# EAGLE design bms (EAGLE 9.6.2)
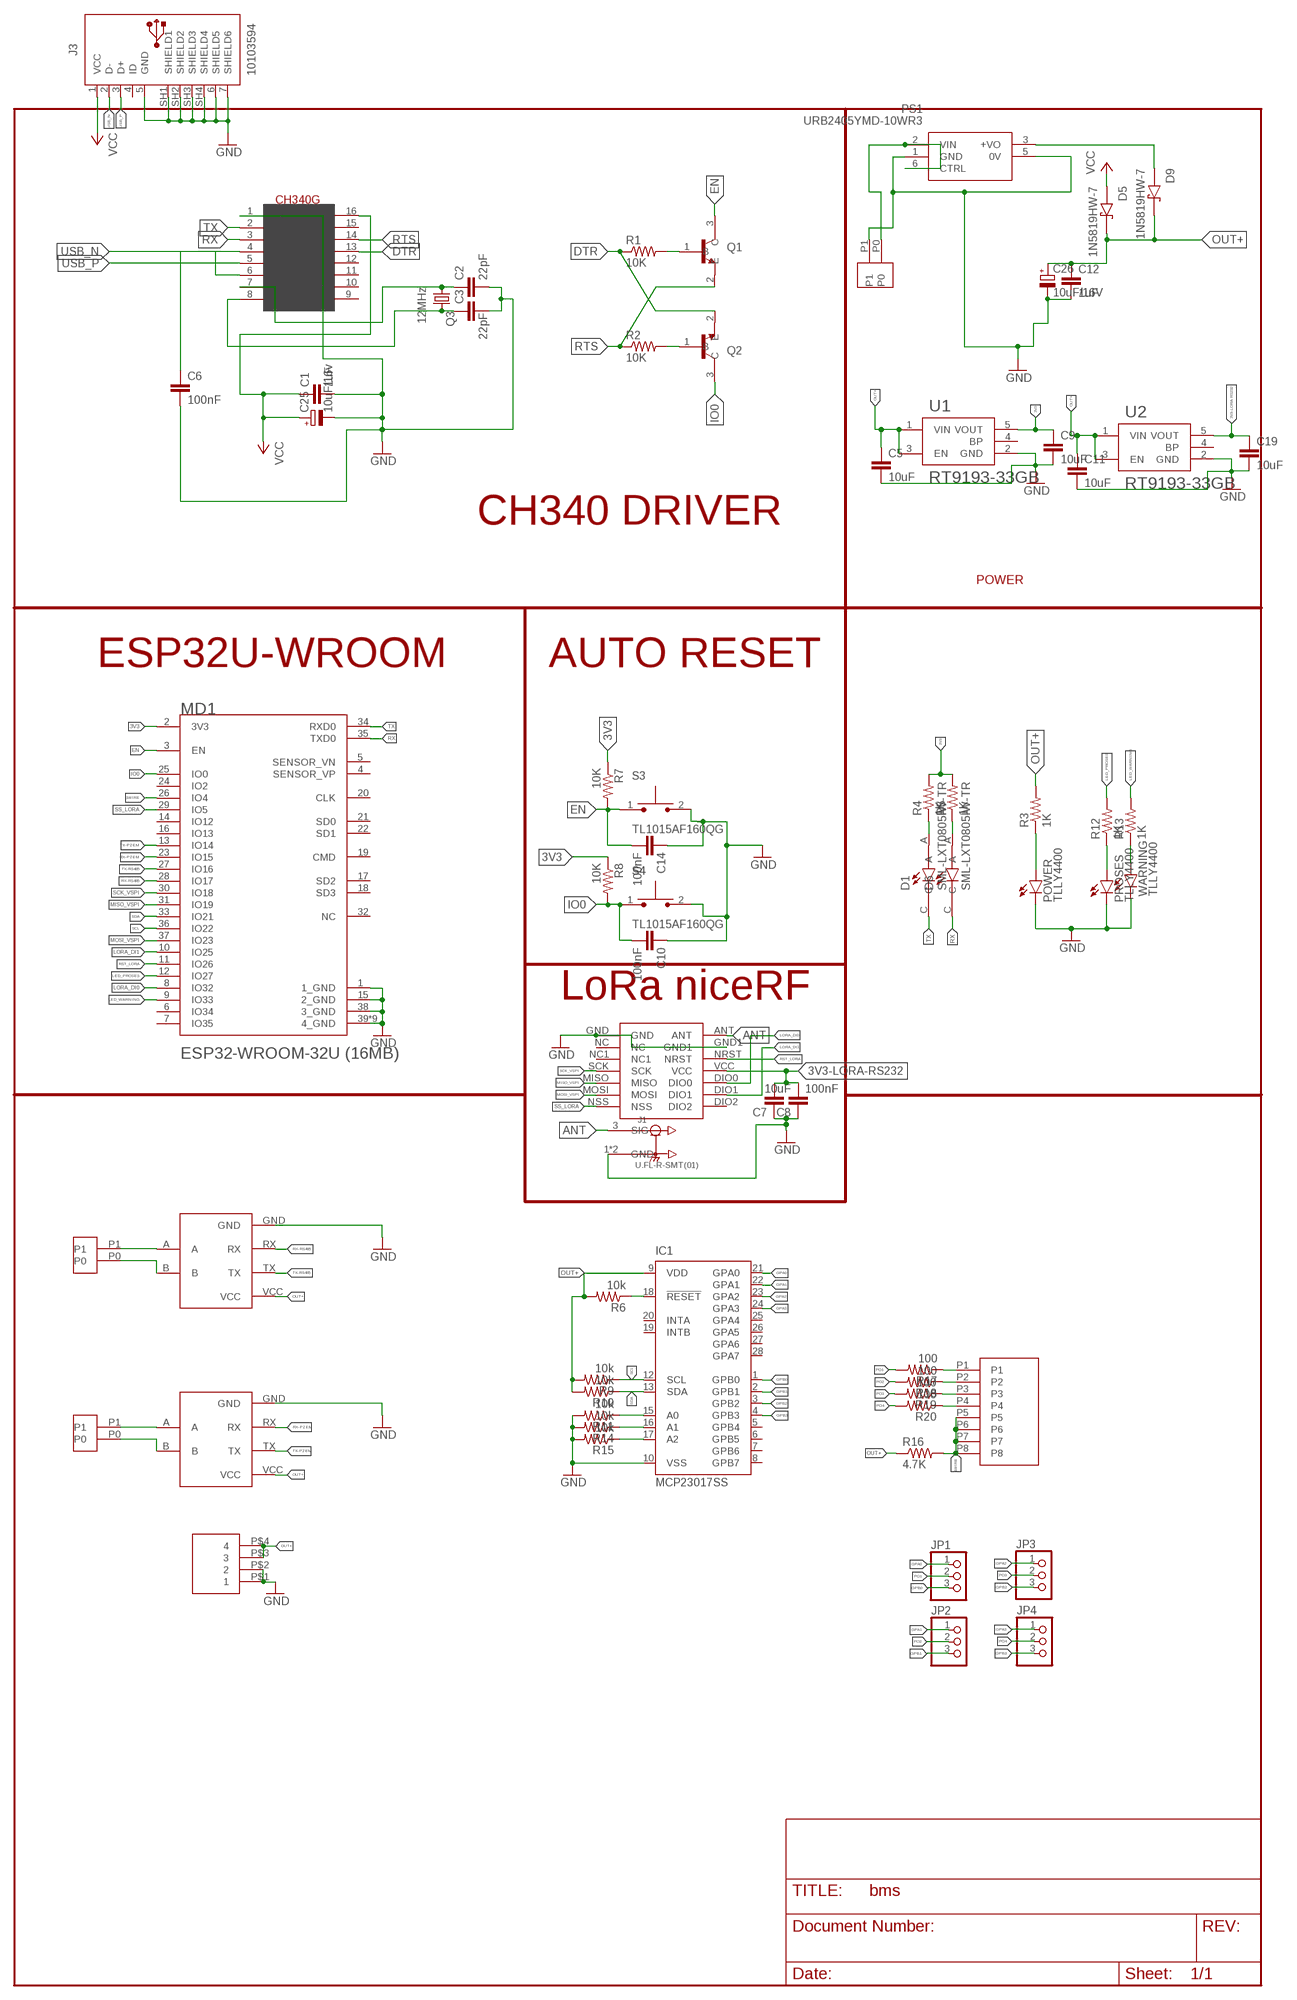
[diagram p0: schematic, sheet 1]

## Parts
C1  1uF  C-EUC0805K  [C0805K]
C2  22pF  C-EUC0805K  [C0805K]
C3  22pF  C-EUC0805K  [C0805K]
C5  10uF  C-EUC0805K  [C0805K]
C6  100nF  C-EUC0805K  [C0805K]
C7  10uF  C-EUC0805K  [C0805K]
C8  100nF  C-EUC0805K  [C0805K]
C9  10uF  C-EUC0805K  [C0805K]
C10  100nF  C-EUC0805K  [C0805K]
C11  10uF  C-EUC0805K  [C0805K]
C12  1uF  C-EUC0805K  [C0805K]
C14  100nF  C-EUC0805K  [C0805K]
C19  10uF  C-EUC0805K  [C0805K]
C25  10uF/16v  CPOL-EU153CLV-0505  [153CLV-0505]
C26  10uF/16V  CPOL-EU153CLV-0505  [153CLV-0505]
CONN2P-3.5PI1  CONN2P-3.5PI  [CONN2P-3.5PI]
CONN2P-3.5PI2  CONN2P-3.5PI  [CONN2P-3.5PI]
CONN2P-3.5PI3  CONN2P-3.5PI  [CONN2P-3.5PI]
CONN3.1  CONN3.5  [CONN3.5]
D1  SML-LXT0805IW-TR  [LEDC2012X120N]
D5  1N5819HW-7  [SOD3715X145N]
D6  SML-LXT0805IW-TR  [LEDC2012X120N]
D9  1N5819HW-7  [SOD3715X145N]
HEADER-3.81-1  HEADER-3.81-4  [HEADER-3.81-4]
IC1  MCP23017SS  [SSOP28]
J1  U.FL-R-SMT(01)  [HRS_U.FL-R-SMT(01)]
J3  10103594  [10103594]
JP1  PINHD-1X3  [1X03]
JP2  PINHD-1X3  [1X03]
JP3  PINHD-1X3  [1X03]
JP4  PINHD-1X3  [1X03]
LORA-NICERF-V1  LORA-NICERF-V2  [LORA-NICERF-V2]
MD1  ESPRESSIF_SYSTEMS_ESP32-WROOM-32U_16MBESPRESSIF_SYSTEMS_ESP32-WROOM-32U_16MB_0_0  [ESPRESSIF_SYSTEMS_ESP32-WROOM-32U_16MB_0]
POWER  TLLY4400  [LED3MM]
PROSES  TLLY4400  [LED3MM]
PS1  URB2405YMD-10WR3  [URB2405YMD10WR3]
Q1  MMBT3904  [SOT95P240X120-3N]
Q2  MMBT3904  [SOT95P240X120-3N]
Q3  12MHz  CRYSTALSM49  [SM49]
R1  10K  R-US_M0805  [M0805]
R2  10K  R-US_M0805  [M0805]
R3  1K  R-US_M0805  [M0805]
R4  1K  R-US_M0805  [M0805]
R5  1K  R-US_M0805  [M0805]
R6  10k  R-US_M0805  [M0805]
R7  10K  R-US_M0805  [M0805]
R8  10K  R-US_M0805  [M0805]
R9  10k  R-US_M0805  [M0805]
R10  10k  R-US_M0805  [M0805]
R11  10k  R-US_M0805  [M0805]
R12  1K  R-US_M0805  [M0805]
R13  1K  R-US_M0805  [M0805]
R14  10k  R-US_M0805  [M0805]
R15  10k  R-US_M0805  [M0805]
R16  4.7K  R-US_M0805  [M0805]
R17  100  R-US_M0805  [M0805]
R18  100  R-US_M0805  [M0805]
R19  100  R-US_M0805  [M0805]
R20  100  R-US_M0805  [M0805]
S3  TL1015AF160QG  [SW_TL1015AF160QG]
S4  TL1015AF160QG  [SW_TL1015AF160QG]
TTL-RS1  TTL-RS485  [TTL-RS485]
TTL-RS2  TTL-RS485  [TTL-RS485]
U1  RT9193-33GB  [SOT94P279X129-5N]
U2  RT9193-33GB  [SOT94P279X129-5N]
U$2  CH340G  [SOIC16]
WARNING  TLLY4400  [LED3MM]

## Nets
1WIRE: CONN3.1.P5 CONN3.1.P6 CONN3.1.P7 CONN3.1.P8 MD1.26(IO4) R16.2
3V3: C9.1 MD1.2(3V3) R4.2 R5.2 R7.1 R8.1 U1.5(VOUT)
3V3-LORA-RS232: C7.2 C8.2 C19.1 LORA-NICERF-V1.VCC U2.5(VOUT)
ANT: J1.3(SIG) LORA-NICERF-V1.ANT
DTR: Q2.2(E) R1.1 U$2.13(DTR)
EN: C14.2 MD1.3(EN) Q1.3(C) R7.2 S3.1
GND: C1.2 C2.2 C3.2 C5.2 C6.2 C7.1 C8.1 C9.2 C10.1 C11.2 C12.2 C14.1 C19.2 C25.- C26.- CONN2P-3.5PI1.P1 HEADER-3.81-1.P$1 HEADER-3.81-1.P$2 IC1.10(VSS) J1.1(GND) J1.2(GND) J3.5(GND) J3.6(SHIELD5) J3.7(SHIELD6) J3.SH1(SHIELD1) J3.SH2(SHIELD2) J3.SH3(SHIELD3) J3.SH4(SHIELD4) LORA-NICERF-V1.GND LORA-NICERF-V1.GND1 MD1.1(1_GND) MD1.15(2_GND) MD1.38(3_GND) MD1.39(4_GND) MD1.39-2(4_GND) MD1.39-3(4_GND) MD1.39-4(4_GND) MD1.39-5(4_GND) MD1.39-6(4_GND) MD1.39-7(4_GND) MD1.39-8(4_GND) MD1.39-9(4_GND) POWER.K(C) PROSES.K(C) PS1.1(GND) PS1.5(0V) R11.2 R14.2 R15.2 S3.2 S4.2 TTL-RS1.GND TTL-RS2.GND U1.2(GND) U2.2(GND) U$2.1(GND) WARNING.K(C)
GPA0: IC1.21(GPA0) JP1.1
GPA1: IC1.22(GPA1) JP2.1
GPA2: IC1.23(GPA2) JP3.1
GPA3: IC1.24(GPA3) JP4.1
GPB0: IC1.1(GPB0) JP1.3
GPB1: IC1.2(GPB1) JP2.3
GPB2: IC1.3(GPB2) JP3.3
GPB3: IC1.4(GPB3) JP4.3
IO0: C10.2 MD1.25(IO0) Q2.3(C) R8.2 S4.1
LED_PROSES: MD1.12(IO27) R12.2
LED_WARNING: MD1.9(IO33) R13.2
LORA_DI0: LORA-NICERF-V1.DIO0 MD1.8(IO32)
LORA_DI1: LORA-NICERF-V1.DIO1 MD1.10(IO25)
MISO_VSPI: LORA-NICERF-V1.MISO MD1.31(IO19)
MOSI_VSPI: LORA-NICERF-V1.MOSI MD1.37(IO23)
N$1: C2.1 Q3.1 U$2.7(XI)
N$2: C3.1 Q3.2 U$2.8(XO)
N$3: POWER.A R3.1
N$4: Q1.1(B) R1.2
N$5: Q2.1(B) R2.2
N$6: CONN2P-3.5PI3.P1 TTL-RS2.A
N$7: CONN2P-3.5PI2.P1 TTL-RS1.A
N$8: D1.A R4.1
N$9: D6.A R5.1
N$10: CONN2P-3.5PI2.P0 TTL-RS1.B
N$11: CONN2P-3.5PI1.P0 PS1.2(VIN) PS1.6(CTRL)
N$12: C6.1 U$2.4(V3)
N$13: CONN2P-3.5PI3.P0 TTL-RS2.B
N$14: IC1.18(!RESET) R6.1
N$15: CONN3.1.P4 R20.1
N$16: D9.A PS1.3(+VO)
N$17: CONN3.1.P3 R19.1
N$18: IC1.15(A0) R11.1
N$19: IC1.16(A1) R14.1
N$20: IC1.17(A2) R15.1
N$21: CONN3.1.P2 R18.1
N$22: CONN3.1.P1 R17.1
N$25: PROSES.A R12.1
N$28: R13.1 WARNING.A
OUT+: C5.1 C11.1 C12.1 C26.+ D5.C(K) D9.C(K) HEADER-3.81-1.P$3 HEADER-3.81-1.P$4 IC1.9(VDD) R3.2 R6.2 R9.2 R10.2 R16.1 TTL-RS1.VCC TTL-RS2.VCC U1.1(VIN) U1.3(EN) U2.1(VIN) U2.3(EN)
PO1: JP1.2 R17.2
PO2: JP2.2 R18.2
PO3: JP3.2 R19.2
PO4: JP4.2 R20.2
RST_LORA: LORA-NICERF-V1.NRST MD1.11(IO26)
RTS: Q1.2(E) R2.1 U$2.14(RTS)
RX: D6.C MD1.35(TXD0) U$2.3(RX)
RX-PZEM: MD1.23(IO15) TTL-RS2.RX
RX-RS485: MD1.28(IO17) TTL-RS1.RX
SCK_VSPI: LORA-NICERF-V1.SCK MD1.30(IO18)
SCL: IC1.12(SCL) MD1.36(IO22) R9.1
SDA: IC1.13(SDA) MD1.33(IO21) R10.1
SS_LORA: LORA-NICERF-V1.NSS MD1.29(IO5)
TX: D1.C MD1.34(RXD0) U$2.2(TX)
TX-PZEM: MD1.13(IO14) TTL-RS2.TX
TX-RS485: MD1.27(IO16) TTL-RS1.TX
USB_N: J3.2(D-) U$2.6(D-)
USB_P: J3.3(D+) U$2.5(D+)
VCC: C1.1 C25.+ D5.A J3.1(VCC) U$2.16(VCC)
Unconnected: IC1.5(GPB4) IC1.6(GPB5) IC1.7(GPB6) IC1.8(GPB7) IC1.19(INTB) IC1.20(INTA) IC1.25(GPA4) IC1.26(GPA5) IC1.27(GPA6) IC1.28(GPA7) J3.4(ID) LORA-NICERF-V1.DIO2 LORA-NICERF-V1.NC LORA-NICERF-V1.NC1 MD1.4(SENSOR_VP) MD1.5(SENSOR_VN) MD1.6(IO34) MD1.7(IO35) MD1.14(IO12) MD1.16(IO13) MD1.17(SD2) MD1.18(SD3) MD1.19(CMD) MD1.20(CLK) MD1.21(SD0) MD1.22(SD1) MD1.24(IO2) MD1.32(NC) U1.4(BP) U2.4(BP) U$2.9(CTS) U$2.10(DSR) U$2.11(RI) U$2.12(DCD) U$2.15(RS232)

## Notes on the sheet
- CH340 DRIVER
- POWER
- ESP32U-WROOM | AUTO RESET
- LoRa niceRF

## Library data of the parts
C1-C3 C5-C12 C14 C19 = rcl:C-EU: CAPACITOR, European symbol; SPICEPREFIX: C
C25 C26 = rcl:CPOL-EU: POLARIZED CAPACITOR, European symbol; SPICEPREFIX: C
CONN2P-3.5PI1-CONN2P-3.5PI3 = CONN2P-3.5PI:CONN2P-3.5PI
CONN3.1 = CONN3.5:CONN3.5
D1 D6 = SML-LXT0805IW-TR:SML-LXT0805IW-TR: LED; Luminous Intensity:11µcd; Viewing Angle:140°; Forward Current:30mA; Forward Voltage:2V; Color:Red; LED Color:Red; Leaded Process Compatible:Yes; Lens Color:White; Mounting Type:Surface Mount ;RoHS Compliant: Yes Check availability <https://pricing.snapeda.com/parts/SML-LXT0805IW-TR/Lumex%20Opto/Components/view-part?ref=eda>; AVAILABILITY: In Stock; DESCRIPTION: Red - LED Indication - Discrete 2V 0805 (2012 Metric); MF: Lumex Opto/Components; MP: SML-LXT0805IW-TR; PACKAGE: 0805 Lumex; PRICE: None; PURCHASE-URL: https://pricing.snapeda.com/search/part/SML-LXT0805IW-TR/?ref=eda
D5 D9 = 1N5819HW-7:1N5819HW-7: 1N5819HW Series 40 V 1 A Surface Mount Schottky Barrier Rectifier - SOD-123 Check availability <https://pricing.snapeda.com/parts/1N5819HW-7/Diodes%20Inc./view-part?ref=eda>; AVAILABILITY: In Stock; DESCRIPTION: Diode Schottky 40 V 1A Surface Mount SOD-123; MF: Diodes Inc.; MP: 1N5819HW-7; PACKAGE: SOD-123 Fairchild Semiconductor; PRICE: None; PURCHASE-URL: https://pricing.snapeda.com/search/part/1N5819HW-7/?ref=eda
HEADER-3.81-1 = HEADER-3.81-4:HEADER-3.81-4
IC1 = microchip:MCP23017: http://ww1.microchip.com/downloads/en/DeviceDoc/21952a.pdf Source: http://ww1.microchip.com/downloads/en/DeviceDoc/21952a.pdf; MF: MICROCHIP; MPN: MCP23017-E/SS; OC_FARNELL: 1467674; OC_NEWARK: 31K2960
J1 = U.FL-R-SMT_01_:U.FL-R-SMT(01): U.FL Series 6 Ghz 50 Ohm Ultra-small SMT Coaxial Cable Receptacle Check availability <https://pricing.snapeda.com/parts/U.FL-R-SMT%2801%29/Hirose/view-part?ref=eda>; AVAILABILITY: In Stock; DESCRIPTION: U.FL (UMCC) Connector Receptacle, Male Pin 50Ohm Surface Mount Solder. RF Connectors / Coaxial Connectors; MF: Hirose; MP: U.FL-R-SMT(01); PACKAGE: None; PRICE: None; PURCHASE-URL: https://pricing.snapeda.com/search/part/U.FL-R-SMT(01)/?ref=eda
J3 = Connector_USB:10103594: USB(2.0) Micro-B, RCPT, 5POS, SMD-THT-R/A Datasheet <https://cdn.amphenol-icc.com/media/wysiwyg/files/documentation/datasheet/inputoutput/io_usb_micro.pdf> Drawing <https://cdn.amphenol-icc.com/media/wysiwyg/files/drawing/10103594.pdf>; CATEGORY: Connectors; CONTACTS: 5; CURRENT-RATING: 1.8A; DESCRIPTION: CONN RCPT USB2.0 MICRO B SMD R/A; GENDER: Receptacle; MANUFACTURER: Amphenol ICC (FCI); MOUNT_TYPE: R/A; MPN: 10103594-0001LF; OPERATING_TEMPERATURE: -30°C ~ 80°C; PART_STATUS: ACTIVE; ROHS_COMPLIANT: COMPLIANT; SUB_CATEGORY: USB; TYPE: USB-micro B; VOLTAGE-RATING: 100VAC
JP1-JP4 = pinhead:PINHD-1X3: PIN HEADER
LORA-NICERF-V1 = LORA-NICERF-V2:LORA-NICERF-V2
MD1 = Espressif Systems - ESP32-WROOM-32U (16MB):ESPRESSIF_SYSTEMS_ESP32-WROOM-32U_16MB: Bluetooth, WiFi 802.11b/g/n, Bluetooth v4.2 +EDR, Class 1, 2 and 3 Transceiver Module 2.4GHz ~ 2.5GHz Antenna Not Included, U.FL Surface Mount; AUTOMOTIVE: No; BANDWIDTH: 72MHz; CENTROID_NOT_SPECIFIED: No; DATASHEET: https://www.espressif.com/sites/default/files/documentation/esp32-wroom-32d_esp32-wroom-32u_datasheet_en.pdf; DATA_RATE: 150Mbits/s; DEVICE_CLASS_L1: Integrated Circuits (ICs); DEVICE_CLASS_L2: RF Semiconductors and Devices; DEVICE_CLASS_L3: Transceivers; DIGIKEY_DESCRIPTION: RX TXRX MODULE WIFI U.FL SMD; DIGIKEY_PART_NUMBER: 1904-1028-1-ND; FOOTPRINT_VARIANT_NAME_0: Recommended_Land_Pattern; HEIGHT: 3.35mm; INTERFACE: I2C,SPI,UART,Ethernet,I2S,Other; LEAD_FREE: Yes; MAX_FREQUENCY: 2484MHz; MAX_SUPPLY_VOLTAGE: 3.6V; MF: Espressif Systems; MFG_PACKAGE_IDENT: 0; MFG_PACKAGE_IDENT_DATE: 0; MFG_PACKAGE_IDENT_REV: 0; MIN_SUPPLY_VOLTAGE: 3V; MOUSER_PART_NUMBER: 356-ES32WROOM32U16MB; MPN: ESP32-WROOM-32U (16MB); NOMINAL_SUPPLY_CURRENT: 0.5A; NUMBER_OF_ADC_CHANNELS: 16; NUMBER_OF_GPIO: 26; PACKAGE: BT_MODULE; PREFIX: MD; ROHS: Yes; SENSITIVITY: -98dBm; TEMPERATURE_RANGE_HIGH: +85°C; TEMPERATURE_RANGE_LOW: -40°C; VERIFICATION_VERSION: 0.0.0.3
POWER PROSES WARNING = led:TLLY4400: Low Current (2mA) LED 3 mm Tinted Diffused Package color YELLOW Source: Data sheet <http://www.farnell.com/datasheets/391098.pdf>; MF: VISHAY SEMICONDUCTOR; OC_FARNELL: 1612439
PS1 = URB2405YMD-10WR3:URB2405YMD-10WR3: Isolated Module DC DC Converter 1 Output 5V 2A 9V - 36V Input Source: Datasheet <https://www.mornsun-power.com/html/pdf/URB2405YMD-10WR3.html>; DESCRIPTION: Isolated Module DC DC Converter 1 Output 5V 2A 9V - 36V Input; HEIGHT: 12.2mm; MANUFACTURER_NAME: Mornsun Power; MANUFACTURER_PART_NUMBER: URB2405YMD-10WR3
Q1 Q2 = MMBT3904:MMBT3904: MMBT3904 Series 40 V CE Breakdown 0.2 A NPN General Purpose Amplifier - SOT-23 Check availability <https://pricing.snapeda.com/parts/MMBT3904/STMicroelectronics/view-part?ref=eda>; AVAILABILITY: Not in stock; DESCRIPTION: SMD Transistor MMBT3904 SOT-23 SMD DIOTEC; MF: STMicroelectronics; MP: MMBT3904; PACKAGE: SOT-23 ON; PRICE: None
Q3 = adafruit:CRYSTAL: CRYSTAL; OC_FARNELL: unknown; OC_NEWARK: unknown
R1-R20 = adafruit:R-US_: RESISTOR, American symbol
S3 S4 = TL1015AF160QG:TL1015AF160QG: Tactile Switch SPST-NO Top Actuated Surface Mount Check availability <https://pricing.snapeda.com/parts/TL1015AF160QG/E-Switch/view-part?ref=eda>; AVAILABILITY: In Stock; DESCRIPTION: Tactile Switch SPST-NO Top Actuated Surface Mount; MF: E-Switch; MP: TL1015AF160QG; PACKAGE: None; PRICE: None; PURCHASE-URL: https://pricing.snapeda.com/search/part/TL1015AF160QG/?ref=eda
TTL-RS1 TTL-RS2 = TTL-RS485:TTL-RS485
U1 U2 = RT9193-33GB:RT9193-33GB: RT9193 Series 300 mA 3.3 V Ultra-Low Noise Ultra-Fast CMOS LDO Regulator-SC-70-5 Check availability <https://pricing.snapeda.com/parts/RT9193-33GB/Richtek%20USA%20Inc./view-part?ref=eda>; AVAILABILITY: In Stock; DESCRIPTION: Linear Voltage Regulator IC Positive Fixed 1 Output 300mA SOT-23-5; MF: Richtek USA Inc.; MP: RT9193-33GB; PACKAGE: SOT-23-5 Richtek; PRICE: None; PURCHASE-URL: https://pricing.snapeda.com/search/part/RT9193-33GB/?ref=eda
U$2 = usb-serial:CH340G

## Net classes
0 default: width 0.2 mm, clearance 0.15 mm

## Board
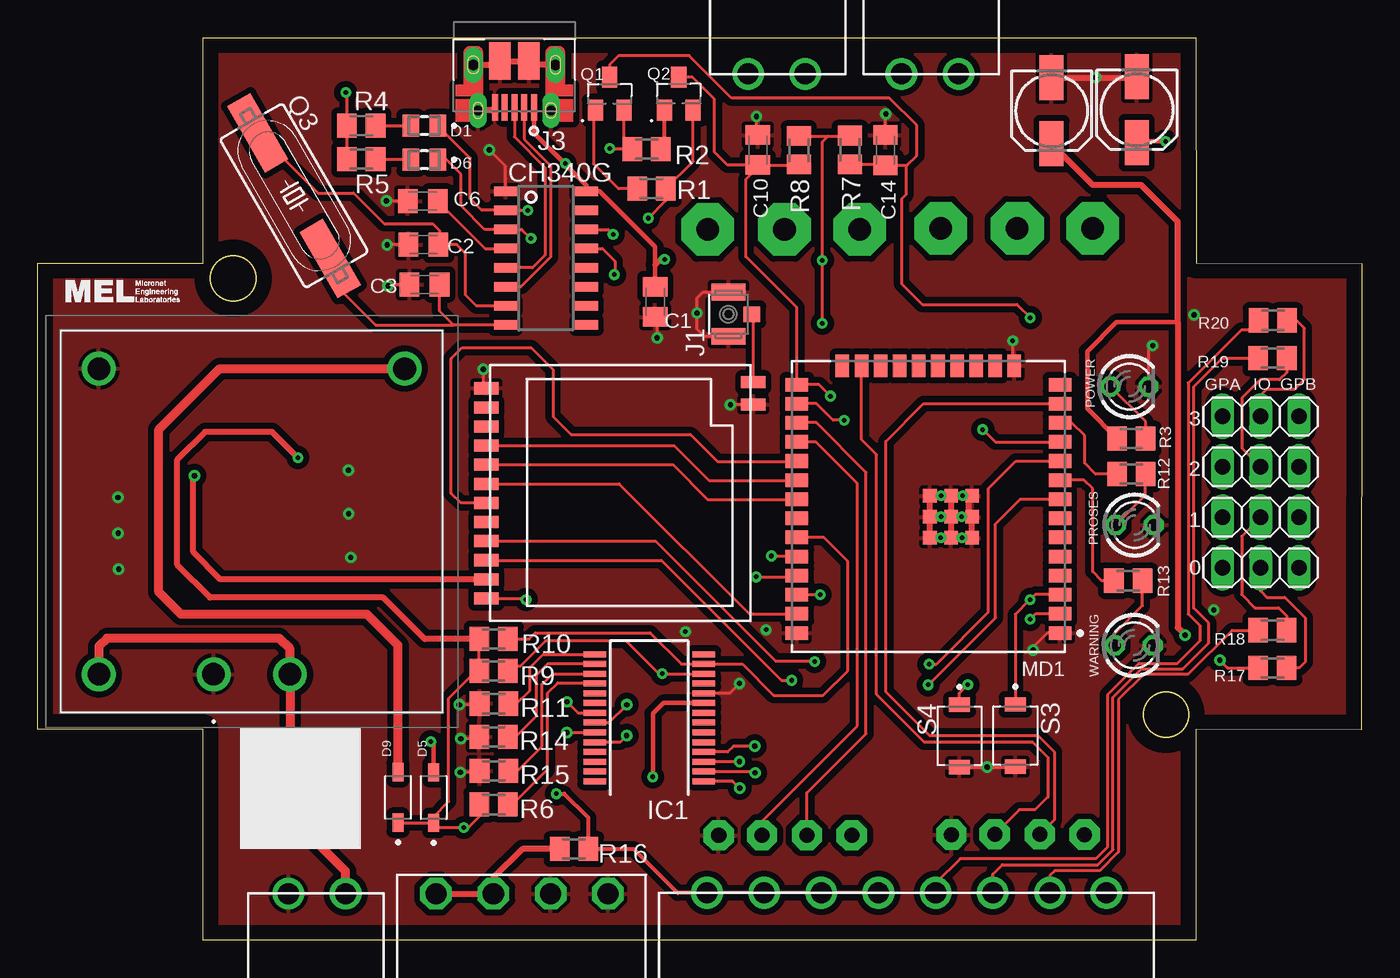
[diagram p1: board, top side]
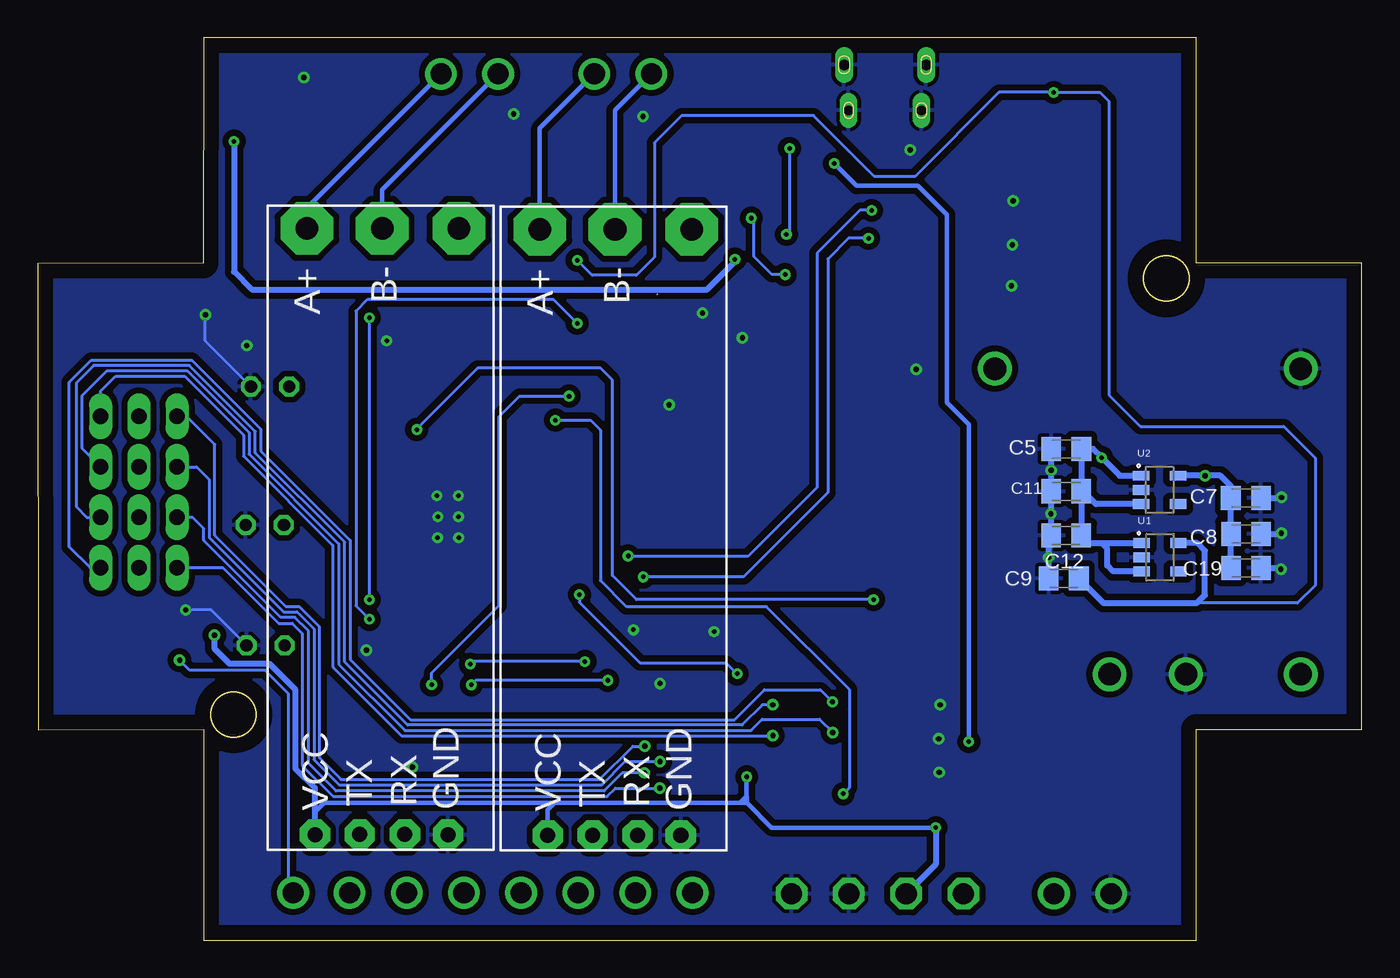
[diagram p2: board, bottom side, seen from below]

Size 88.02 x 60 mm. Coordinates in mm from the lower left corner, seen from the top.
Outline: 11,60 77,60 77.03,44.99 88.03,44.98 87.99,13.99 76.99,14.01 77,0 11,0 11,14 0,14 0,45 11,45 11,60
Outline: circle at 13,44 radius 1.5
Outline: circle at 75,15 radius 1.5
Copper layers (1*16): Top 0.035mm / dielectric 1.5mm / Bottom 0.035mm
Design rules "default *": minimum track width 6mil, minimum drill 0.3mm, track to track 6mil, track to pad 6mil, pad to pad 6mil, via to via 6mil, smd to smd 6mil, copper to edge 40mil, drill to drill 6mil, minimum pad ring 10mil, minimum via ring 8mil, stop-mask expansion 4mil, vias tented up to drill 0mil, thermal gap 10mil

### Footprints (pad centres in the part's own frame; a part is rotated, then mirrored left to right if it is on the bottom)
C0805K = smd 1.3 x 1.6: 1 -1,0; 2 1,0
153CLV-0505 = smd 3 x 1.6: + 2.2,0; - -2.2,0
CONN2P-3.5PI = drill 1.4: P0 2.521,0.016; P1 6.321,0.016
CONN3.5 = drill 1.4: P1 -26.75,0; P2 -23,0; P3 -19.2,0; P4 -15.4,0; P5 -11.6,0; P6 -7.8,0; P7 -4,0; P8 -0.2,0
LEDC2012X120N = smd 1.1 x 1.45: A 0.9,0; C -0.9,0
SOD3715X145N = smd 1.21 x 0.73: A 1.68,0; C -1.68,0
HEADER-3.81-4 = drill 1.4 octagon: P$1 0,0; P$2 3.81,0; P$3 7.62,0; P$4 11.43,0
SSOP28 = smd 0.4 x 1.5: 1 -4.225,-3.625; 2 -3.575,-3.625; 3 -2.925,-3.625; 4 -2.275,-3.625; 5 -1.625,-3.625; 6 -0.975,-3.625; 7 -0.325,-3.625; 8 0.325,-3.625; 9 0.975,-3.625; 10 1.625,-3.625; 11 2.275,-3.625; 12 2.925,-3.625; 13 3.575,-3.625; 14 4.225,-3.625; 15 4.225,3.625; 16 3.575,3.625; 17 2.925,3.625; 18 2.275,3.625; 19 1.625,3.625; 20 0.975,3.625; 21 0.325,3.625; 22 -0.325,3.625; 23 -0.975,3.625; 24 -1.625,3.625; 25 -2.275,3.625; 26 -2.925,3.625; 27 -3.575,3.625; 28 -4.225,3.625
HRS_U.FL-R-SMT(01) = smd 1.1 x 2.25: 1 -1.475,0; 2 1.475,0 | smd 1.05 x 1.1: 3 0,-1.55
10103594 = smd 0.4 x 1.75: 1 -1.3,2.825; 2 -0.65,2.825; 3 0,2.825; 4 0.65,2.825; 5 1.3,2.825 | smd 1.425 x 2.5: 6 -0.963,-0.25; 7 0.963,-0.25 | drill 0.65 pad 0.73 long: SH1 -2.425,3.03; SH2 2.425,3.03 | drill 0.7 long: SH3 -2.725,0; SH4 2.725,0
1X03 = drill 1.016 long: 1 -2.54,0; 2 0,0; 3 2.54,0
LORA-NICERF-V2 = smd 1.6 x 0.8: ANT 9.17,6.81; DIO0 -8.57,-5.03; DIO1 -8.57,-3.76; DIO2 -8.57,-2.49; GND -8.57,6.4; GND1 9.17,5.31; MISO -8.57,1.32; MOSI -8.57,0.05; NC -8.57,5.13; NC1 -8.57,3.86; NRST -8.57,-7.57; NSS -8.57,-1.22; SCK -8.57,2.59; VCC -8.57,-6.3
ESPRESSIF_SYSTEMS_ESP32-WROOM-32U_16MB_0 = smd 1.5 x 0.9: 1 -8.75,8.41; 2 -8.75,7.14; 3 -8.75,5.87; 4 -8.75,4.6; 5 -8.75,3.33; 6 -8.75,2.06; 7 -8.75,0.79; 8 -8.75,-0.48; 9 -8.75,-1.75; 10 -8.75,-3.02; 11 -8.75,-4.29; 12 -8.75,-5.56; 13 -8.75,-6.83; 14 -8.75,-8.1; 25 8.75,-8.1; 26 8.75,-6.83; 27 8.75,-5.56; 28 8.75,-4.29; 29 8.75,-3.02; 30 8.75,-1.75; 31 8.75,-0.48; 32 8.75,0.79; 33 8.75,2.06; 34 8.75,3.33; 35 8.75,4.6; 36 8.75,5.87; 37 8.75,7.14; 38 8.75,8.41 | smd 0.9 x 1.5: 15 -5.71,-9.35; 16 -4.44,-9.35; 17 -3.17,-9.35; 18 -1.9,-9.35; 19 -0.63,-9.35; 20 0.64,-9.35; 21 1.91,-9.35; 22 3.18,-9.35; 23 4.45,-9.35; 24 5.72,-9.35 | smd 0.9 x 0.9: 39 -2.9,2.09; 39-2 -1.5,0.69; 39-3 -1.5,2.09; 39-4 -0.1,2.09; 39-5 -0.1,-0.71; 39-6 -1.5,-0.71; 39-7 -2.9,-0.71; 39-8 -0.1,0.69; 39-9 -2.9,0.69
LED3MM = drill 0.813 octagon: A -1.27,0; K 1.27,0
URB2405YMD10WR3 = drill 1.5 pad 2.25: 1 0,0; 2 -5.08,0; 3 -12.7,-20.32; 5 7.62,-20.32; 6 7.62,0
SOT95P240X120-3N = smd 1 x 1.4: 1 -0.95,-1.1; 2 0.95,-1.1; 3 0,1.1
SM49 = smd 5.08 x 1.778: 1 -4.826,0; 2 4.826,0
M0805 = smd 1.3 x 1.6: 1 -0.95,0; 2 0.95,0
SW_TL1015AF160QG = smd 0.95 x 1.4: 1 -2.075,0; 2 2.075,0
TTL-RS485 = drill 1.5 pad 3.5 octagon: A -19.7,-6; B -19.7,-1; P$7 -19.7,4.1 | drill 1 pad 2 octagon: GND 20.6,3.37; RX 20.581,0.505; TX 20.583,-2.493; VCC 20.6,-5.47
SOT94P279X129-5N = smd 1.17 x 0.67: 1 -1.22,0.94; 2 -1.22,0; 3 -1.22,-0.94; 4 1.22,-0.94; 5 1.22,0.94
SOIC16 = smd 0.635 x 1.524: 1 -4.445,-2.695; 2 -3.175,-2.695; 3 -1.905,-2.695; 4 -0.635,-2.695; 5 0.635,-2.695; 6 1.905,-2.695; 7 3.175,-2.695; 8 4.445,-2.695; 9 4.445,2.695; 10 3.175,2.695; 11 1.905,2.695; 12 0.635,2.695; 13 -0.635,2.695; 14 -1.905,2.695; 15 -3.175,2.695; 16 -4.445,2.695

### Placement (x,y rotation side)
C1  41.05,42.44 270 top
C2  25.65,46.24 180 top
C3  25.72,43.59 180 top
C5  19.65,32.65 180 bottom
C6  25.6,49.12 180 top
C7  7.71,29.39 180 bottom
C8  7.7,27.01 180 bottom
C9  19.81,24.04 180 bottom
C10  47.87,52.52 270 top
C11  19.65,29.84 180 bottom
C12  19.65,26.89 180 bottom
C14  56.36,52.52 270 top
C19  7.7,24.74 0 bottom
C25  73.06,55.21 270 top
C26  67.4,55.14 270 top
CONN2P-3.5PI1  22.99,3.1 180 top
CONN2P-3.5PI2  44.7,57.57 0 top
CONN2P-3.5PI3  54.9,57.58 0 top
CONN3.1  44.29,3.15 180 top
D1  25.7,54.15 180 top
D5  26.33,9.48 90 top
D6  25.7,51.88 180 top
D9  23.96,9.49 90 top
HEADER-3.81-1  37.91,3.09 180 top
IC1  40.66,14.79 90 top
J1  45.92,41.61 90 top
J3  31.69,58.19 180 top
JP1  81.3,24.76 180 top
JP2  81.3,28.11 180 top
JP3  81.3,31.46 180 top
JP4  81.3,34.82 180 top
LORA-NICERF-V1  38.4,30.29 0 top
MD1  59.21,28.83 180 top
POWER  72.58,36.81 0 top
PROSES  72.93,27.6 0 top
PS1  11.69,17.67 180 top
Q1  38.02,56.27 0 top
Q2  42.62,56.28 0 top
Q3  17.04,49.49 300 top
R1  40.8,49.95 180 top
R2  40.48,52.59 0 top
R3  72.7,33.34 180 top
R4  21.52,54.15 180 top
R5  21.52,51.91 180 top
R6  30.31,9.01 180 top
R7  53.99,52.53 270 top
R8  50.6,52.51 270 top
R9  30.31,17.89 180 top
R10  30.32,20.02 180 top
R11  30.33,15.72 180 top
R12  72.69,30.98 180 top
R13  72.49,23.89 180 top
R14  30.31,13.51 180 top
R15  30.33,11.26 180 top
R16  35.65,6.07 0 top
R17  82.08,18.1 0 top
R18  82.08,20.61 0 top
R19  82.08,38.7 0 top
R20  82.11,41.21 0 top
S3  64.99,13.6 270 top
S4  61.28,13.58 270 top
TTL-RS1  48.64,27.55 270 bottom
TTL-RS2  64.12,27.61 270 bottom
U1  13.42,25.45 0 bottom
U2  13.45,29.93 0 bottom
U$2  33.79,45.34 270 top
WARNING  72.87,19.6 0 top

### Tracks (layer width: path | path; a pad name or v marks a point on that pad's centre or on a via)
1WIRE  (via drill 0.3)
  Top 0.203: CONN3.1.P5 CONN3.1.P6 CONN3.1.P7 CONN3.1.P8 | v53.61,34.57 52.87,34.57 51.78,35.66 MD1.26
  Top 0.254: v34.48,9.73 35,9.73 36.6,8.16 R16.2 39.62,6.07 42.54,3.15 CONN3.1.P8
  Bottom 0.203: v34.48,9.73 34.07,10.14 34.07,16.66 39.57,22.16 48.87,22.16 50.62,23.91 50.62,33.91 51.27,34.57 v53.61,34.57
3V3  (via drill 0.3)
  Top 0.203: R5.2 R4.2 | R4.2 | R8.1 52.54,53.46 | 52.54,53.46 53.97,53.46 R7.1 | MD1.2 66.33,21.69 v65.97,21.33 | v52.16,41.02 v52.16,45.2 52.16,53.08 52.54,53.46 | R4.2 20.57,56.31 20.5,56.38 | 20.5,56.38 | 20.5,56.38 v20.48,56.36
  Bottom 0.203: v65.97,21.33 66.86,22.22 66.86,41.83 66.09,42.6 53.75,42.6 v52.16,41.02 | 11.38,22.4 4.28,22.4 3.11,23.57 3.11,32.06 5.2,34.16 14.72,34.16 16.81,36.25 16.81,55.77 17.4,56.36 v20.48,56.36 24.11,56.36 29.7,50.77 32.41,50.77 36.45,54.81 45.22,54.81 47.02,53.01 47.02,45.41 48.23,44.21 51.17,44.21 v52.16,45.2
  Bottom 0.305: 18.7,23.93 C9.1
  Bottom 0.406: C9.1 17.17,22.4 11.38,22.4 10.98,22.4 10.43,22.95 10.43,25.88 10.94,26.39 U1.5
3V3-LORA-RS232  (via drill 0.35)
  Top 0.406: LORA-NICERF-V1.VCC 12.15,23.99 10.34,25.79 10.34,30.86 10.42,30.93 v10.42,30.87
  Bottom 0.406: U2.5 v10.42,30.87 9.4,30.87 8.71,30.19 C7.2 C8.2 | C19.1 C8.2 | C8.2
ANT
  Top 0.203: LORA-NICERF-V1.ANT 47.57,41.51 J1.3
DTR  (via drill 0.3)
  Top 0.203: Q2.2 43.57,51.77 R1.1 41.75,49.16 v40.59,48 | U$2.13 37.53,45.98 38.38,45.14 38.38,44.29 v38.34,44.25
  Bottom 0.203: v38.34,44.25 39.2,44.25 40.43,45.48 40.43,47.84 v40.59,48
EN  (via drill 0.3)
  Top 0.203: R7.2 56.29,51.58 C14.2 57.71,51.52 | 57.71,51.52 57.79,51.52 58.43,52.16 58.43,54.17 56.62,55.98 46.13,55.98 43.3,58.81 38.63,58.81 38.02,58.2 Q1.3 | S3.1 64.99,21.66 v65.97,22.64 66.34,23.01 67.91,23.01 MD1.3 | 57.71,51.52 57.71,49.56 57.43,49.28 57.43,43.63 58.8,42.26 65.1,42.26 v65.98,41.38
  Bottom 0.203: v65.98,41.38 65.98,22.73 65.92,22.67 65.95,22.64 v65.97,22.64
GND  (via drill 0.3, 0.35)
  Top 0.203: R15.2 29.26,11.15 v28.1,11.15 | R14.2 29.24,13.39 v28.14,13.39 | R11.2 29.3,15.64 v28.03,15.64 | v46.65,17.06 46,16.41 IC1.10 | S4.2 v63.11,11.5 64.97,11.5 S3.2 | J3.SH2 28.97,55.46 J3.SH4 | 24.65,49.06 C6.2 23.22,49.12 v23.19,49.14 v23.18,49.14 | 24.72,46.23 24.65,46.3 C2.2 23.25,46.24 23.23,46.23 v23.23,46.21 | C3.2 23.38,43.59 v23.29,43.5 | LORA-NICERF-V1.GND 29.63,36.89 v29.63,37.96 | U$2.1 31.1,50.58 31.12,50.6 31.12,51.45 v30.03,52.53 | J1.1 44.32,40.13 43.83,40.62 v43.83,41.69 43.83,42.7 44.21,43.08 J1.2 | C1.2 41.18,41.31 v41.18,40.05 | LORA-NICERF-V1.GND1 v46.05,35.59 | C14.1 56.36,54.89 v56.38,54.92 | C10.1 47.78,53.61 v47.78,54.77 | MD1.1 67.13,20.42 66.17,19.46 v66.17,19.28 | MD1.15 64.82,38.28 v64.82,39.84 | POWER.K 73.85,39.25 v74.12,39.52
  Top 0.406: J3.5 30.19,55.16 J3.SH2 29.07,55.36 29.07,58.19 | J3.SH4 29.07,58.19 | 29.07,58.19 30.48,58.19 30.68,58.39 | 30.68,58.39 J3.7 | J3.6 32.61,58.39 | 32.61,58.39 30.68,58.39 | 32.61,58.39 32.81,58.19 J3.SH3 34.42,55.46 J3.SH1 | C26.- v70.32,57.34 72.99,57.34 C25.- | MD1.39-3 v60.04,26.74 MD1.39-4 MD1.39-8 | MD1.39-3 v61.44,26.74 MD1.39 MD1.39-9 61.86,28.14 | 61.86,28.14 v61.43,28.14 MD1.39-2 | MD1.39-2 MD1.39-3 | MD1.39-8 v60.04,28.14 MD1.39-2 | MD1.39-2 | MD1.39-8 MD1.39-5 v60.05,29.54 MD1.39-6 | MD1.39-6 MD1.39-2 | MD1.39-6 v61.48,29.54 MD1.39-7 61.86,29.29 61.86,28.14
  Bottom 0.203: POWER.K 76.88,39.83 v76.88,41.57 | WARNING.K 76.5,21.95 v78.18,21.95
  Bottom 0.406: C9.2 20.81,26.73 C12.2 C11.2 v20.65,31.23 C5.2 | C19.2 5.46,24.74 v5.39,24.67 | C8.1 5.4,27.01 v5.35,27.06 | C7.1 5.37,29.39 v5.33,29.43
  other vias: 20.81,25.44 20.68,28.35 43.06,20.5 48.42,20.62
  pour Bottom (isolate 0.406): 11,60 77,60 77.03,44.99 87.99,44.99 87.99,14 77,14 77,0 11,0 11,14 0,14 0,45 11,45
  pour Top (isolate 0.406): 11,60 77,60 77.03,44.99 87.99,44.99 87.99,14 77,14 77,0 11,0 11,14 0,14 0,45 11,45
GPA0  (via drill 0.35)
  Top 0.203: v35.19,15.84 35.92,15.11 IC1.21
  Bottom 0.203: JP1.1 84.54,24.76 85.91,26.13 85.91,37.1 84.45,38.56 77.78,38.56 73.18,33.97 73.18,32.53 67.24,26.58 67.24,18.65 63.25,14.66 41.72,14.66 39.72,16.65 36.01,16.65 v35.19,15.84
GPA1  (via drill 0.35)
  Top 0.203: IC1.22 37.98,14.46 v39.16,15.64
  Bottom 0.203: v39.16,15.64 39.85,15.64 41.19,14.3 63.43,14.3 67.61,18.49 67.61,26.46 73.56,32.39 73.56,33.82 77.94,38.21 84.3,38.21 85.46,37.05 85.46,28.82 84.75,28.11 JP2.1
GPA2  (via drill 0.35)
  Top 0.203: v35.17,13.8 IC1.23
  Bottom 0.203: JP3.1 85.06,32.69 85.06,36.2 83.41,37.85 78.09,37.85 73.97,33.73 73.97,32.31 68.01,26.34 68.01,18.34 63.61,13.95 40.59,13.95 39.86,14.68 36.05,14.68 v35.17,13.8
GPA3  (via drill 0.35)
  Top 0.203: v39.15,13.59 38.72,13.16 IC1.24
  Bottom 0.203: JP4.1 83.84,36.49 82.83,37.5 78.25,37.5 74.34,33.59 74.34,32.18 68.41,26.24 68.41,18.16 63.84,13.59 v39.15,13.59
GPB0  (via drill 0.35)
  Top 0.203: v46.66,10.1 46.2,10.56 IC1.1
  Bottom 0.203: v46.66,10.1 49.62,10.1 50.17,9.54 68.38,9.54 70.43,11.59 70.43,20.38 71.1,21.06 72,21.06 75.71,24.76 JP1.3
GPB1  (via drill 0.35)
  Top 0.203: IC1.2 47.6,11.21 v47.69,11.12
  Bottom 0.203: v47.69,11.12 49.18,11.12 50.37,9.92 68.18,9.92 70.02,11.76 70.02,20.55 70.93,21.46 71.85,21.46 76.97,26.58 76.97,27.36 77.73,28.11 JP2.3
GPB2  (via drill 0.35)
  Top 0.203: v46.65,11.87 v46.64,11.86 IC1.3
  Bottom 0.203: JP3.3 77.46,31.47 76.61,30.62 76.61,26.75 71.69,21.83 70.78,21.83 69.66,20.7 69.66,11.99 68,10.33 50.52,10.33 48.98,11.87 v46.65,11.87
GPB3  (via drill 0.35)
  Top 0.203: v47.67,12.89 46.25,12.89 45.87,12.51 IC1.4
  Bottom 0.203: JP4.3 78.11,34.82 76.25,32.95 76.25,26.91 71.53,22.18 70.64,22.18 69.31,20.85 69.31,12.14 67.85,10.68 50.67,10.68 48.46,12.89 v47.67,12.89
IO0  (via drill 0.3)
  Top 0.203: 48.02,51.52 C10.2 45.86,51.52 44.99,52.39 44.99,55.91 43.52,57.38 Q2.3 | 48.02,51.52 50.57,51.52 R8.2 | S4.1 61.28,16.42 v61.83,16.98 | v52.7,36.17 51.94,36.93 MD1.25 50.46,42.06 47.08,45.44 47.08,50.59 48.02,51.52
  Bottom 0.203: v61.83,16.98 61.83,17.77 57.36,22.25 57.36,34.8 55.99,36.17 v52.7,36.17
LED_PROSES
  Top 0.203: R12.2 70.32,30.98 69.59,31.7 69.59,33.54 68.74,34.39 MD1.12
LED_WARNING
  Top 0.203: R13.2 70.74,23.89 70.13,24.5 70.13,30.01 69.56,30.58 MD1.9
LORA_DI0  (via drill 0.3)
  Top 0.203: LORA-NICERF-V1.DIO0 41.46,25.26 49.45,17.27 v50.13,17.27 | MD1.8 65.32,29.31 63.67,27.67 63.67,21.42 59.22,16.97 v59.2,16.97
  Bottom 0.203: v50.13,17.27 58.9,17.27 v59.2,16.97
LORA_DI1  (via drill 0.3)
  Top 0.203: LORA-NICERF-V1.DIO1 41.08,26.53 49.04,18.57 51.64,18.57 v51.64,18.52 | v59.26,18.34 59.73,18.34 63.19,21.8 63.19,30.02 65.03,31.85 MD1.10
  Bottom 0.203: v51.64,18.52 59.07,18.52 v59.26,18.34
MISO_VSPI
  Top 0.203: LORA-NICERF-V1.MISO 42.22,31.61 44.54,29.29 50.44,29.29 MD1.31
MOSI_VSPI
  Top 0.203: LORA-NICERF-V1.MOSI 38.66,30.34 47.31,21.69 MD1.37
N$1
  Top 0.203: U$2.7 29.17,42.17 28.44,42.89 28.44,45.65 27.85,46.24 26.73,46.24 | 26.73,46.24 C2.1 | Q3.1 18.63,49.67 20.99,49.67 23.04,47.62 26.26,47.62 26.73,47.16 26.73,46.24
N$2
  Top 0.203: U$2.8 27.97,40.9 27.64,40.9 | C3.1 26.72,41.82 27.64,40.9 | Q3.2 19.45,43.92 22.47,40.9 27.64,40.9
N$3
  Top 0.203: R3.1 73.65,34.47 POWER.A
N$4
  Top 0.203: R1.2 38.62,49.95 36.95,51.62 36.95,55.05 Q1.1
N$5
  Top 0.203: R2.2 41.67,52.83
  Top 0.254: 41.67,52.83 Q2.1
N$6
  Bottom 0.305: TTL-RS2.A 70.12,48.69 CONN2P-3.5PI3.P1
N$7
  Bottom 0.305: TTL-RS1.A 54.64,53.97 CONN2P-3.5PI2.P1
N$8
  Top 0.203: R4.1 D1.A
N$9
  Top 0.203: R5.1 24.76,51.91 D6.A
N$10
  Bottom 0.305: TTL-RS1.B 49.64,55.17 CONN2P-3.5PI2.P0
N$11
  Top 0.61: CONN2P-3.5PI1.P0 20.47,4.58 16.77,8.28 PS1.2 16.77,19.35 16.05,20.07 4.61,20.07 4.07,19.53 PS1.6
N$12
  Top 0.203: U$2.4 29.74,45.98 C6.1
N$13
  Bottom 0.305: TTL-RS2.B 65.12,49.89 CONN2P-3.5PI3.P0
N$14
  Top 0.203: R6.1 31.58,9.01 33.9,11.34 33.9,16.43 34.58,17.11 36.98,17.11 IC1.18
N$15
  Top 0.203: R20.1 80.5,40.55 80,40.55 76.49,37.04 76.49,21.69 77.3,20.88 77.3,19.93 75.77,18.4 73.2,18.4 71.11,16.31 71.11,6.18 70.35,5.42 61.33,5.42 59.69,3.78 CONN3.1.P4
N$16
  Top 0.61: D9.A 23.96,19.59 21.9,21.66 9.54,21.66 8.05,23.15 8.05,33.94 12.11,38 PS1.3
N$17
  Top 0.203: CONN3.1.P3 63.49,4.39 64.12,5.01 70.48,5.01 71.48,6.02 71.48,16.15 73.37,18.03 76.12,18.03 77.84,19.76 77.84,21.08 76.84,22.08 76.84,36.79 78.75,38.7 R19.1
N$18
  Top 0.203: R11.1 31.84,15.72 32.72,16.61 32.72,18.13 33.6,19.01 IC1.15
N$19
  Top 0.203: R14.1 31.77,13.51 33.16,14.9 33.16,17.64 33.88,18.36 IC1.16
N$20
  Top 0.203: R15.1 31.9,11.26 33.52,12.89 33.52,17 34.23,17.71 IC1.17
N$21
  Top 0.203: R18.1 79.4,20.6 76.46,17.67 73.52,17.67 71.84,15.99 71.84,5.87 70.6,4.62 67.6,4.62 67.29,4.31 CONN3.1.P2
N$22  (via drill 0.35)
  Top 0.203: v78.58,18.61 79.09,18.1 R17.1
  Bottom 0.203: CONN3.1.P1 71.34,3.45 71.34,16.38 72.89,17.94 77.91,17.94 v78.58,18.61
N$25
  Top 0.203: PROSES.A 73.64,29.58 R12.1
N$28
  Top 0.203: WARNING.A 71.6,20.39 73.44,22.23 R13.1
OUT+  (via drill 0.3, 0.35)
  Top 0.203: D9.C D5.C | R6.2 29.36,8.24 28.6,7.48 v28.32,7.48 26.65,7.48 D5.C | R10.2 R9.2 29.14,17.89 27.33,16.09 27.33,9.21 26.32,8.21 D5.C
  Top 0.305: 75.78,41.08 71.72,41.08 69.77,39.13 69.77,35.33 R3.2 | IC1.9 41.59,15.76 40.89,15.06 v40.89,10.85
  Top 0.406: C26.+ 70.14,50.2 73.35,50.2 75.78,47.77 75.78,41.08 75.78,20.78 v76.28,20.28 | R10.2 25.73,20.02 22.98,22.78 11.46,22.78 9.28,24.96 9.28,31.94 11.13,33.79 15.58,33.79 v17.3,32.08 | HEADER-3.81-1.P$4 HEADER-3.81-1.P$3 30.29,4.13 32.22,6.07 R16.1
  Bottom 0.305: TTL-RS2.VCC 69.59,8.51 68.98,9.13 53.66,9.13 | v40.89,10.85 40.89,9.53 | 40.88,9.13 40.88,9.53 40.89,9.53 | 40.88,9.13 39.24,7.48 v28.32,7.48 | 53.66,9.13 54.11,8.67 TTL-RS1.VCC | 53.66,9.13 41.34,9.13 | 41.34,9.13 40.88,9.13 | 40.89,9.53 40.94,9.53 41.34,9.13
  Bottom 0.406: 18.65,29.97 C5.1 17.88,32.65 v17.3,32.08 16.1,30.87 U2.1 | 18.65,29.97 C11.1 C12.1 18.15,26.39 17.3,26.39 | 17.3,26.39 U1.1 | U2.3 17.68,28.99 18.65,29.97 | U1.3 16.55,24.51 16.93,24.9 16.93,26.03 17.3,26.39 | v28.32,7.48 28.32,5.05 HEADER-3.81-1.P$3 | TTL-RS2.VCC 69.59,10.11 70.88,11.4 70.88,16.63 72.65,18.39 75.28,18.39 76.28,19.4 v76.28,20.28
PO1
  Top 0.203: JP1.2 81.3,23.2 81.71,22.79 82.89,22.79 84.26,21.42 84.26,18.48 83.88,18.1 R17.2
PO2
  Top 0.203: JP2.2 80.03,26.84 80.03,22.98 80.92,22.09 82.49,22.09 83.03,21.55 R18.2
PO3
  Top 0.203: R19.2 83.03,37.74 82.55,37.26 81.26,37.26 80.06,36.05 80.06,32.71 JP3.2
PO4
  Top 0.203: JP4.2 81.3,36.24 81.71,36.65 83.58,36.65 84.2,37.28 84.2,40.68 83.68,41.2 R20.2
RST_LORA  (via drill 0.3)
  Top 0.203: LORA-NICERF-V1.NRST 32.39,22.72 v32.47,22.64 | v62.83,33.94 63.65,33.12 MD1.11
  Bottom 0.203: v32.47,22.64 48.23,22.64 49.83,24.24 49.83,37.25 50.61,38.03 58.78,38.03 62.83,33.98 v62.83,33.94
RTS  (via drill 0.3)
  Top 0.203: R2.1 39.43,52.69 | 39.43,52.69 38.97,53.15 Q1.2 | U$2.14 37.92,47.25 v38.25,46.92 | v38.04,52.63 39.36,52.63 39.43,52.69
  Bottom 0.203: v38.25,46.92 38.04,47.12 v38.04,52.63
RX  (via drill 0.3)
  Top 0.203: D6.C 27.18,51.88 28.14,50.92 28.14,48.83 29.72,47.25 U$2.3 32.18,47.25 32.77,46.66 v32.8,46.66 | v47.76,24.15 50.38,24.15 MD1.35
  Bottom 0.203: v32.8,46.66 34.13,46.66 35.51,45.28 35.51,29.76 41.12,24.15 v47.76,24.15
RX-PZEM
  Top 0.203: TTL-RS2.RX 65.25,8.66 66.3,8.66 67.16,9.52 67.16,12.14 66.14,13.16 58.95,13.16 55.76,16.34 55.76,32.28 54.76,33.27 MD1.23
RX-RS485
  Top 0.203: TTL-RS1.RX 48.14,7.9 54.49,14.25 54.49,30.37 51.74,33.12 MD1.28
SCK_VSPI
  Top 0.203: LORA-NICERF-V1.SCK 42.31,32.88 44.62,30.57 MD1.30
SCL  (via drill 0.3)
  Top 0.203: R9.1 31.58,18.21 32.08,18.21 33.78,19.91 39.09,19.91 41.29,17.71 v41.53,17.71 IC1.12 | v52.01,22.96 MD1.36
  Bottom 0.203: v41.53,17.71 42.25,18.43 47.98,18.43 52.01,22.46 v52.01,22.96
SDA
  Top 0.203: R10.1 32.67,20.02 33.08,20.44 40.72,20.44 42.8,18.36 IC1.13 46.84,18.36 48.93,16.27 52.22,16.27 53.85,17.91 53.85,25.17 52.26,26.77 MD1.33
SS_LORA
  Top 0.203: LORA-NICERF-V1.NSS 28.13,29.07 27.49,29.71 27.49,38.66 28.22,39.39 32.8,39.39 34.27,37.92 34.27,34.8 35.46,33.61 43.4,33.61 45.19,31.82 50.43,31.82 MD1.29
TX  (via drill 0.3)
  Top 0.203: D1.C 28.75,52 28.75,49.29 29.52,48.52 U$2.2 v32.58,48.52 | v48.78,25.54 50.42,25.54 MD1.34
  Bottom 0.203: v32.58,48.52 33.36,48.52 36.22,45.67 36.22,30.11 40.81,25.51 48.76,25.51 v48.78,25.53 v48.78,25.54
TX-PZEM
  Top 0.203: TTL-RS2.TX 67.57,7.99 67.57,12.53 66.52,13.58 59.3,13.58 56.38,16.51 56.38,33.15 58.89,35.66 MD1.13
TX-RS485
  Top 0.203: TTL-RS1.TX 51.14,9.79 55.07,13.73 55.07,31.1 51.77,34.4 MD1.27
USB_N
  Top 0.203: J3.2 32.34,53.25 34.09,51.5 34.09,45.41 32.12,43.44 U$2.6
USB_P
  Top 0.203: J3.3 31.69,53.4 33.73,51.37 33.73,45.54 32.89,44.71 U$2.5
VCC  (via drill 0.3)
  Top 0.305: C1.1 41.05,44.9 41.05,46.1 37.37,49.79 U$2.16 36.49,50.16 34.34,52.3 | J3.1 32.99,53.65 34.34,52.3 | D5.A 26.32,13 v26.13,13.2 | v35.07,51.63 34.39,52.3 34.34,52.3 | v74.97,53.11 73.16,53.11 C25.+
  Top 0.406: v41.67,45.27 41.42,45.27 41.05,44.9
  Bottom 0.305: v26.13,13.2 26.13,34.28 27.6,35.74 27.6,48.24 29.51,50.15 33.59,50.15 v35.07,51.63
  Bottom 0.406: v74.97,53.11 74.97,44.44 73.78,43.25 43.53,43.25 41.67,45.11 v41.67,45.27

### Text on the board
tNames: GPA | IO | GPB | 3 | 2 | 1 | 0